# EAGLE design ATMEGA16v4 (EAGLE 7.6.0)

## Sheet 1 of 2
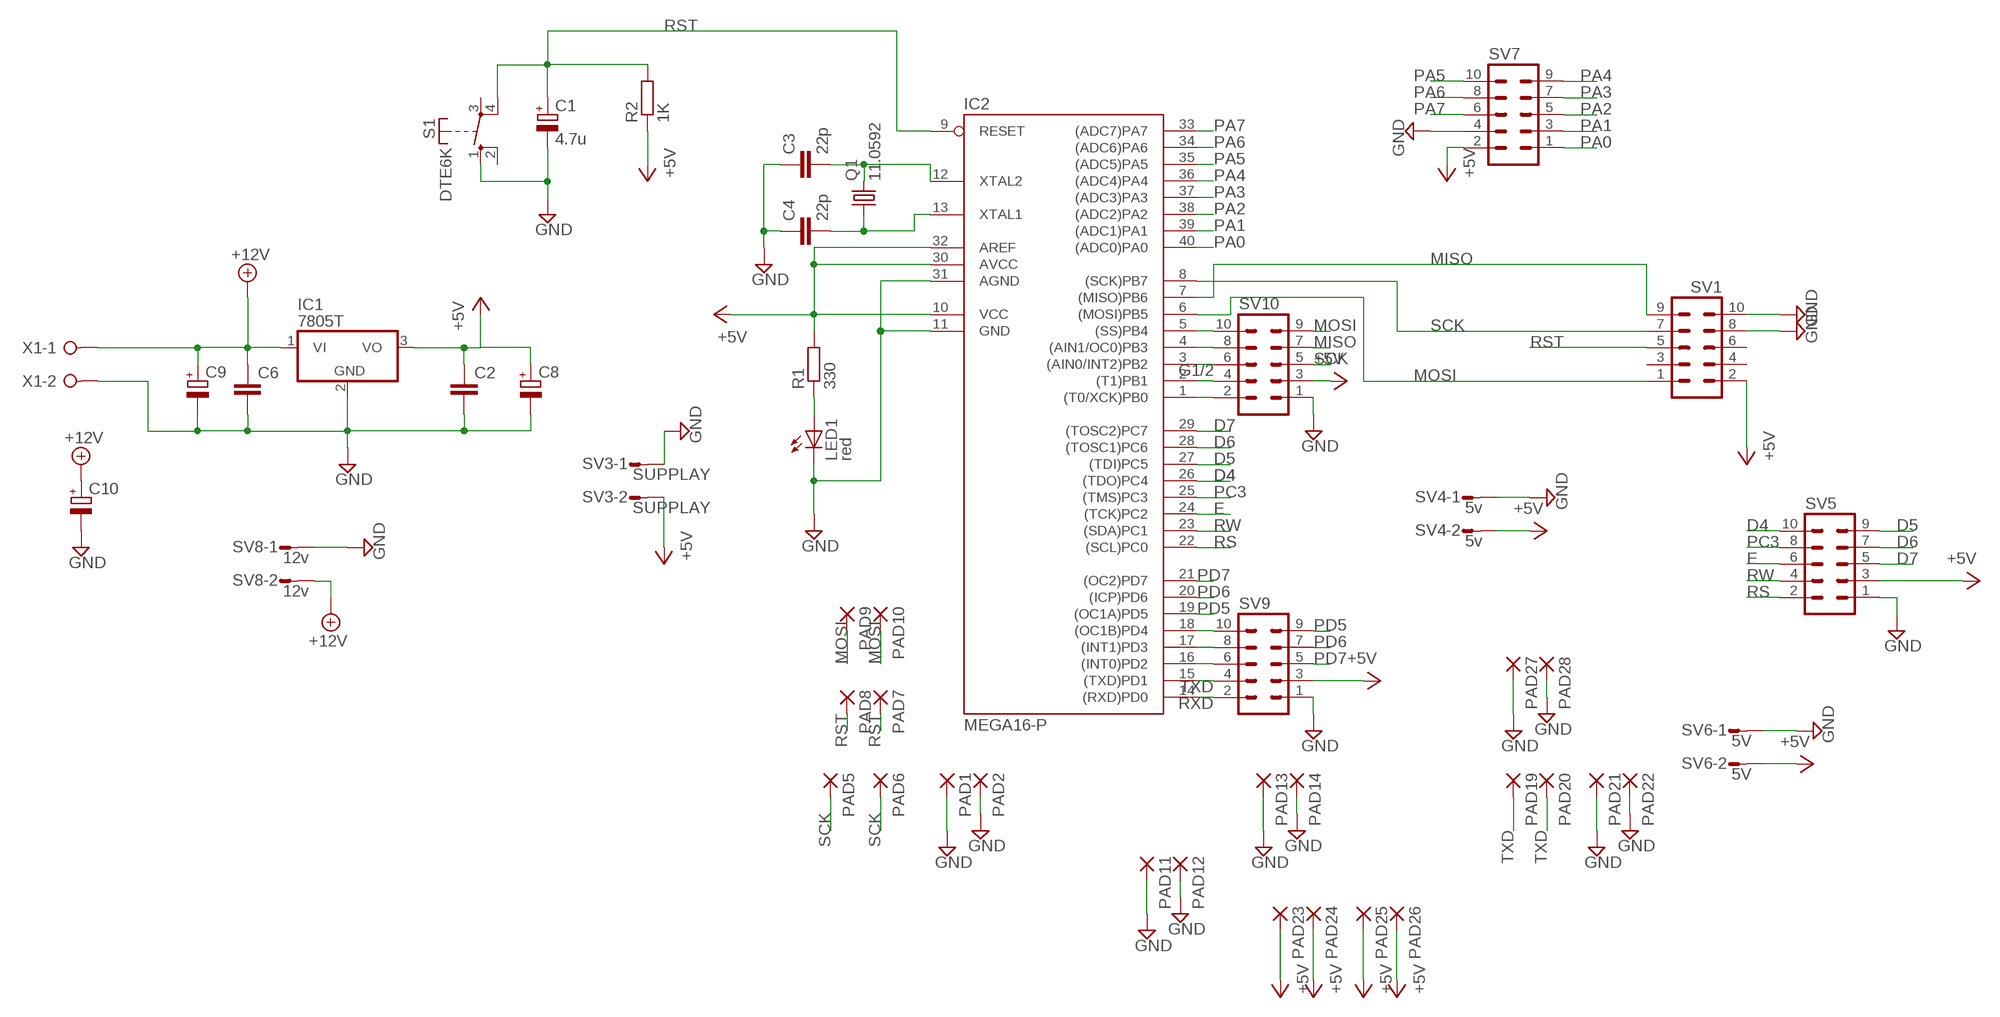
[diagram p0: schematic, sheet 1]

### Parts
C1  4.7u  CPOL-EUE2-5  [E2-5]
C2  C-EU050-050X075  [C050-050X075]
C3  22p  C-EU025-040X050  [C025-040X050]
C4  22p  C-EU025-040X050  [C025-040X050]
C6  C-EU050-050X075  [C050-050X075]
C8  CPOL-EUE2.5-7  [E2,5-7]
C9  CPOL-EUE2.5-7  [E2,5-7]
C10  CPOL-EUE5-13  [E5-13]
IC1  7805T  [TO220H]
IC2  MEGA16-P  [DIL40]
LED1  red  LED3MM  [LED3MM]
PAD1  1,6/0,9  [1,6/0,9]
PAD2  1,6/0,9  [1,6/0,9]
PAD5  1,6/0,9  [1,6/0,9]
PAD6  1,6/0,9  [1,6/0,9]
PAD7  1,6/0,9  [1,6/0,9]
PAD8  1,6/0,9  [1,6/0,9]
PAD9  1,6/0,9  [1,6/0,9]
PAD10  1,6/0,9  [1,6/0,9]
PAD11  1,6/0,9  [1,6/0,9]
PAD12  1,6/0,9  [1,6/0,9]
PAD13  1,6/0,9  [1,6/0,9]
PAD14  1,6/0,9  [1,6/0,9]
PAD19  1,6/0,9  [1,6/0,9]
PAD20  1,6/0,9  [1,6/0,9]
PAD21  1,6/0,9  [1,6/0,9]
PAD22  1,6/0,9  [1,6/0,9]
PAD23  1,6/0,9  [1,6/0,9]
PAD24  1,6/0,9  [1,6/0,9]
PAD25  1,6/0,9  [1,6/0,9]
PAD26  1,6/0,9  [1,6/0,9]
PAD27  1,6/0,9  [1,6/0,9]
PAD28  1,6/0,9  [1,6/0,9]
Q1  11.0592  CRYSTALHC49U-V  [HC49U-V]
R1  330  R-EU_0309/12  [0309/12]
R2  1K  R-EU_0309/12  [0309/12]
S1  DTE6K  [DTE6K]
SV1  ML10  [ML10]
SV3  SUPPLAY  L02P  [L02P]
SV4  5v  L02P  [L02P]
SV5  ML10  [ML10]
SV6  5V  L02P  [L02P]
SV7  ML10  [ML10]
SV8  12v  L02P  [L02P]
SV9  ML10  [ML10]
SV10  ML10  [ML10]
X1  W237-02P  [W237-132]

### Nets
+5V: C2.1 C8.+ IC1.3(VO) IC2.10(VCC) IC2.30(AVCC) IC2.32(AREF) PAD23.1(P) PAD24.1(P) PAD25.1(P) PAD26.1(P) R1.2 R2.1 SV1.2 SV3.2 SV4.2 SV5.3 SV6.2 SV7.2 SV9.3 SV10.3
+12V: C6.1 C9.+ C10.+ IC1.1(VI) SV8.2 X1.1 ; also sheet 2
D4: IC2.26((TDO)PC4) SV5.10
D5: IC2.27((TDI)PC5) SV5.9
D6: IC2.28((TOSC1)PC6) SV5.7
D7: IC2.29((TOSC2)PC7) SV5.5
E: IC2.24((TCK)PC2) SV5.6
G1/2: IC2.2((T1)PB1) SV10.4
GND: C1.- C2.2 C3.1 C4.1 C6.2 C8.- C9.- C10.- IC1.2(GND) IC2.11(GND) IC2.31(AGND) LED1.K(C) PAD1.1(P) PAD2.1(P) PAD11.1(P) PAD12.1(P) PAD13.1(P) PAD14.1(P) PAD21.1(P) PAD22.1(P) PAD27.1(P) PAD28.1(P) S1.1(S) SV1.8 SV1.10 SV3.1 SV4.1 SV5.1 SV6.1 SV7.4 SV8.1 SV9.1 SV10.1 X1.2 ; also sheet 2
MISO: IC2.7((MISO)PB6) SV1.9 SV10.7
MOSI: IC2.6((MOSI)PB5) PAD9.1(P) PAD10.1(P) SV1.1 SV10.9
N$4: LED1.A R1.1
N$5: C3.2 IC2.12(XTAL2) Q1.2
N$6: C4.2 IC2.13(XTAL1) Q1.1
N$16: IC2.18((OC1B)PD4) SV9.10
N$17: IC2.17((INT1)PD3) SV9.8
N$18: IC2.16((INT0)PD2) SV9.6
N$29: IC2.5((SS)PB4) SV10.10
N$30: IC2.4((AIN1/OC0)PB3) SV10.8
N$31: IC2.3((AIN0/INT2)PB2) SV10.6
N$33: IC2.1((T0/XCK)PB0) SV10.2
PA0: IC2.40((ADC0)PA0) SV7.1
PA1: IC2.39((ADC1)PA1) SV7.3
PA2: IC2.38((ADC2)PA2) SV7.5
PA3: IC2.37((ADC3)PA3) SV7.7
PA4: IC2.36((ADC4)PA4) SV7.9
PA5: IC2.35((ADC5)PA5) SV7.10
PA6: IC2.34((ADC6)PA6) SV7.8
PA7: IC2.33((ADC7)PA7) SV7.6
PC3: IC2.25((TMS)PC3) SV5.8
PD5: IC2.19((OC1A)PD5) SV9.9
PD6: IC2.20((ICP)PD6) SV9.7
PD7: IC2.21((OC2)PD7) SV9.5
RS: IC2.22((SCL)PC0) SV5.2
RST: C1.+ IC2.9(RESET) PAD7.1(P) PAD8.1(P) R2.2 S1.4(P) SV1.5
RW: IC2.23((SDA)PC1) SV5.4
RXD: IC2.14((RXD)PD0) SV9.2 ; also sheet 2
SCK: IC2.8((SCK)PB7) PAD5.1(P) PAD6.1(P) SV1.7 SV10.5
TXD: IC2.15((TXD)PD1) PAD19.1(P) PAD20.1(P) SV9.4 ; also sheet 2
Unconnected: S1.2(S) S1.3(P) SV1.3 SV1.4 SV1.6

## Sheet 2 of 2
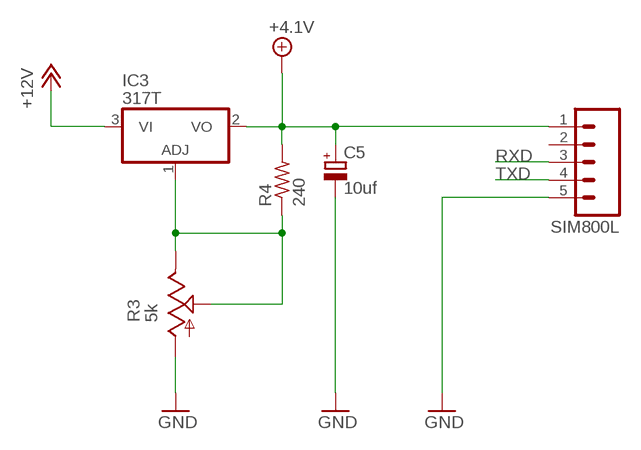
[diagram p1: schematic, sheet 2]

### Parts
C5  10uf  CPOL-EUE2.5-5  [E2,5-5]
IC3  317T  [TO220H]
R3  5k  TRIM_US-CA6V  [CA6V]
R4  240  R-US_0207/12  [0207/12]
SIM800L  M05  [05P]

### Nets
+4.1V: C5.+ IC3.2(VO) R4.2 SIM800L.1
+12V: IC3.3(VI) ; also sheet 1
GND: C5.- R3.A SIM800L.5 ; also sheet 1
N$1: IC3.1(ADJ) R3.E R3.S R4.1
RXD: SIM800L.3 ; also sheet 1
TXD: SIM800L.4 ; also sheet 1
Unconnected: SIM800L.2

## Library data of the parts
C1 C5 C8-C10 = rcl:CPOL-EU: POLARIZED CAPACITOR, European symbol
C2 C6 = rcl:C-EU: CAPACITOR, European symbol
C3 C4 = resistor:C-EU: CAPACITOR, European symbol
IC1 = linear:78*: Positive VOLTAGE REGULATOR Source: http://cache.national.com/ds/LM/LM78L05.pdf http://www.fairchildsemi.com/ds/LM/LM7805.pdf
IC2 = atmel:MEGA16-P: MICROCONTROLLER 16 Kbytes FLASH 1 kbytes SRAM 512 bytes EEPROM USART 8-channel 10 bit ADC Source: avr.lbr
IC3 = linear:*317: Positive VOLTAGE REGULATOR
LED1 = led:LED: LED OSRAM: - CHIPLED LG R971, LG N971, LY N971, LG Q971, LY Q971, LO R971, LY R971 LH N974, LH R974 LS Q976, LO Q976, LY Q976 LO Q996 - Hyper CHIPLED LW Q18S LB Q993, LB Q99A, LB R99A - SideLED LS A670, LO A670, LY A670, LG A670, LP A670 LB A673, LV A673, LT A673, LW A673 LH A674 LY A675 LS A676, LA A676, LO A676, LY A676, LW A676 LS A679, LY A679, LG A679 - Hyper Micro SIDELED® LS Y876, LA Y876, LO Y876, LY Y876 LT Y87S - SmartLED LW L88C, LW L88S LB L89C, LB L89S, LG L890 LS L89K, LO L89K, LY L89K LS L896, LA L896, LO L896, LY L896 - TOPLED LS T670, LO T670, LY T670, LG T670, LP T670 LSG T670, LSP T670, LSY T670, LOP T670, LYG T670 LG T671, LOG T671, LSG T671 LB T673, LV T673, LT T673, LW T673 LH T674 LS T676, LA T676, LO T676, LY T676, LB T676, LH T676, LSB T676, LW T676 LB T67C, LV T67C, LT T67C, LS T67K, LO T67K, LY T67K, LW E67C LS E67B, LA E67B, LO E67B, LY E67B, LB E67C, LV E67C, LT E67C LW T67C LS T679, LY T679, LG T679 LS T770, LO T770, LY T770, LG T770, LP T770 LB T773, LV T773, LT T773, LW T773 LH T774 LS E675, LA E675, LY E675, LS T675 LS T776, LA T776, LO T776, LY T776, LB T776 LHGB T686 LT T68C, LB T68C - Hyper Mini TOPLED® LB M676 - Mini TOPLED Santana® LG M470 LS M47K, LO M47K, LY M47K Source: http://www.osram.convergy.de LUXEON: - LUMILED® LXK2-PW12-R00, LXK2-PW12-S00, LXK2-PW14-U00, LXK2-PW14-V00 LXK2-PM12-R00, LXK2-PM12-S00, LXK2-PM14-U00 LXK2-PE12-Q00, LXK2-PE12-R00, LXK2-PE12-S00, LXK2-PE14-T00, LXK2-PE14-U00 LXK2-PB12-K00, LXK2-PB12-L00, LXK2-PB12-M00, LXK2-PB14-N00, LXK2-PB14-P00, LXK2-PB14-Q00 LXK2-PR12-L00, LXK2-PR12-M00, LXK2-PR14-Q00, LXK2-PR14-R00 LXK2-PD12-Q00, LXK2-PD12-R00, LXK2-PD12-S00 LXK2-PH12-R00, LXK2-PH12-S00 LXK2-PL12-P00, LXK2-PL12-Q00, LXK2-PL12-R00 Source: www.luxeon.com KINGBRIGHT: KA-3528ASYC Source: www.kingbright.com
PAD1 PAD2 PAD5-PAD14 PAD19-PAD28 = wirepad:1,6/0,9: THROUGH-HOLE PAD
Q1 = crystal:CRYSTAL: CRYSTAL
R1 R2 = resistor:R-EU_: RESISTOR, European symbol
R3 = pot:TRIM_US-: POTENTIOMETER
R4 = rcl:R-US_: RESISTOR, American symbol
S1 = switch-misc:DT: ITT SWITCH
SIM800L = con-amp-quick:M05: AMP QUICK CONNECTOR; OC_FARNELL: unknown; OC_NEWARK: unknown
SV1 SV5 SV7 SV9 SV10 = con-harting-ml:ML10: HARTING; OC_FARNELL: unknown; OC_NEWARK: unknown
SV3 SV4 SV6 SV8 = con-amp-mt:L02P: AMP MT CONNECTOR; OC_FARNELL: unknown; OC_NEWARK: unknown
X1 = con-wago-508:W237-02P: WAGO SREW CLAMP; OC_FARNELL: unknown; OC_NEWARK: unknown

## Net classes
0 default: width 1.524 mm, drill 1.524 mm, clearance 1.016 mm

## Board
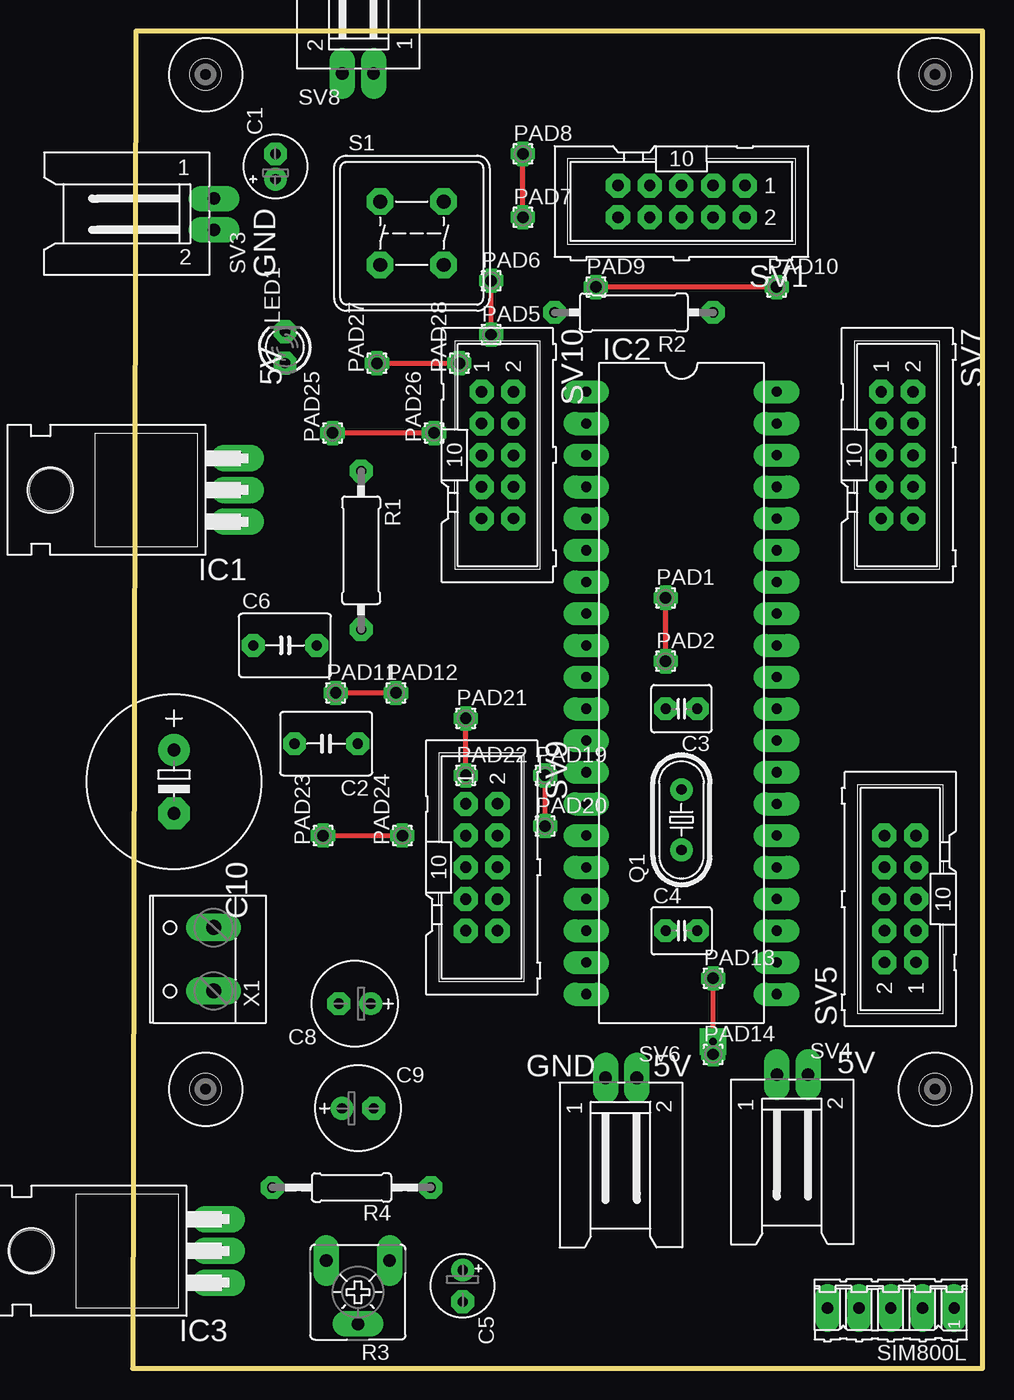
[diagram p2: board, top side]
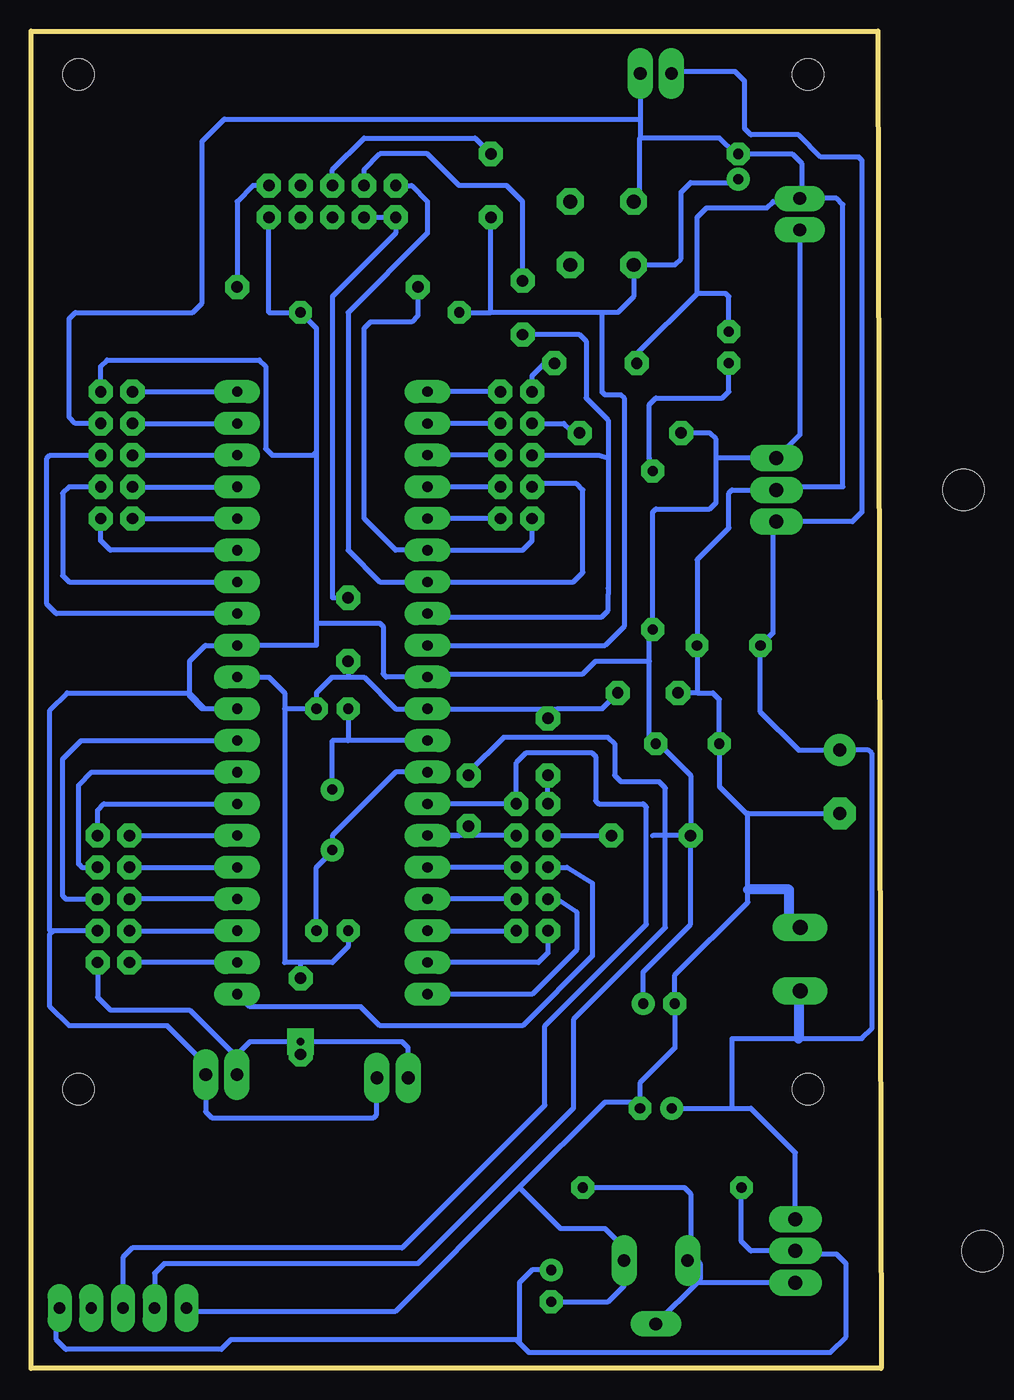
[diagram p3: board, bottom side, seen from below]

Size 68.05 x 107.11 mm. Coordinates in mm from the lower left corner, seen from the top.
Outline: 0,0 68.05,0 68.05,107.11 0.25,107.11 0,0
Copper layers 16: Bottom 0.035mm
Design rules "setting": minimum track width 30mil, minimum drill 25mil, track to track 30mil, track to pad 30mil, pad to pad 30mil, via to via 30mil, smd to smd 8mil, copper to edge 50mil, drill to drill 30mil, minimum pad ring 20mil, minimum via ring 30mil, stop-mask expansion 0mil, vias tented up to drill 0mil, thermal gap 10mil

### Footprints (pad centres in the part's own frame; a part is rotated, then mirrored left to right if it is on the bottom)
E2-5 = drill 0.813 pad 1.27: + -1.016,0 | drill 0.813 pad 1.27 octagon: - 1.016,0
C050-050X075 = drill 0.813 octagon: 1 -2.54,0; 2 2.54,0
C025-040X050 = drill 0.813 octagon: 1 -1.27,0; 2 1.27,0
E2,5-5 = drill 0.813 pad 1.6: + -1.27,0 | drill 0.813 pad 1.6 octagon: - 1.27,0
E2,5-7 = drill 0.813 pad 1.6: + -1.27,0 | drill 0.813 pad 1.6 octagon: - 1.27,0
E5-13 = drill 1.016 pad 2.54: + -2.54,0 | drill 1.016 pad 2.54 octagon: - 2.54,0
TO220H = drill 1.118 long: 1 -2.54,-10.16; 2 0,-10.16; 3 2.54,-10.16 | hole 3.302: 0,4.826
DIL40 = drill 0.813 long: 1 -24.13,-7.62; 2 -21.59,-7.62; 3 -19.05,-7.62; 4 -16.51,-7.62; 5 -13.97,-7.62; 6 -11.43,-7.62; 7 -8.89,-7.62; 8 -6.35,-7.62; 9 -3.81,-7.62; 10 -1.27,-7.62; 11 1.27,-7.62; 12 3.81,-7.62; 13 6.35,-7.62; 14 8.89,-7.62; 15 11.43,-7.62; 16 13.97,-7.62; 17 16.51,-7.62; 18 19.05,-7.62; 19 21.59,-7.62; 20 24.13,-7.62; 21 24.13,7.62; 22 21.59,7.62; 23 19.05,7.62; 24 16.51,7.62; 25 13.97,7.62; 26 11.43,7.62; 27 8.89,7.62; 28 6.35,7.62; 29 3.81,7.62; 30 1.27,7.62; 31 -1.27,7.62; 32 -3.81,7.62; 33 -6.35,7.62; 34 -8.89,7.62; 35 -11.43,7.62; 36 -13.97,7.62; 37 -16.51,7.62; 38 -19.05,7.62; 39 -21.59,7.62; 40 -24.13,7.62
LED3MM = drill 0.813 octagon: A -1.27,0; K 1.27,0
1,6/0,9 = drill 0.914 pad 1.6 octagon: 1 0,0
HC49U-V = drill 0.813: 1 -2.413,0; 2 2.413,0
0309/12 = drill 0.813 octagon: 1 -6.35,0; 2 6.35,0
CA6V = drill 1.016 long: A -2.54,-2.54; E 2.54,-2.54; S 0,2.54
0207/12 = drill 0.813 octagon: 1 -6.35,0; 2 6.35,0
DTE6K = drill 1.118 octagon: 1 -2.54,2.54; 2 2.54,2.54; 3 2.54,-2.54; 4 -2.54,-2.54
05P = drill 0.914 long: 1 -5.08,0; 2 -2.54,0; 3 0,0; 4 2.54,0; 5 5.08,0
ML10 = drill 0.914 octagon: 1 -5.08,-1.27; 2 -5.08,1.27; 3 -2.54,-1.27; 4 -2.54,1.27; 5 0,-1.27; 6 0,1.27; 7 2.54,-1.27; 8 2.54,1.27; 9 5.08,-1.27; 10 5.08,1.27
L02P = drill 1.016 long: 1 1.25,-6.25; 2 -1.25,-6.25
DRIL-2,5 = hole 2.5: 0,0
W237-132 = drill 1.194 long: 1 -2.54,-0.635; 2 2.54,-0.635

### Placement (x,y rotation side)
C1  11.43,96.27 90 top
C2  15.49,50.04 180 top
C3  43.94,52.83 180 top
C4  43.94,35.05 0 top
C5  26.42,6.6 270 top
C6  12.19,57.91 0 top
C8  17.78,29.21 180 top
C9  18.03,20.83 0 top
C10  3.3,46.99 270 top
IC1  -1.78,70.36 90 top
IC2  43.94,54.1 270 top
IC3  -3.3,9.4 90 top
LED1  12.19,81.79 90 top
PAD1  42.67,61.72 0 top
PAD2  42.67,56.64 0 top
PAD5  28.7,82.8 0 top
PAD6  28.7,87.12 0 top
PAD7  31.24,92.2 0 top
PAD8  31.24,97.28 0 top
PAD9  37.08,86.61 0 top
PAD10  51.56,86.61 0 top
PAD11  16.26,54.1 0 top
PAD12  21.08,54.1 0 top
PAD13  46.48,31.24 0 top
PAD14  46.48,25.15 0 top
PAD19  33.02,47.5 0 top
PAD20  33.02,43.43 0 top
PAD21  26.67,52.07 0 top
PAD22  26.67,47.5 0 top
PAD23  15.24,42.67 90 top
PAD24  21.59,42.67 90 top
PAD25  16,74.93 90 top
PAD26  24.13,74.93 90 top
PAD27  19.56,80.52 90 top
PAD28  26.16,80.52 90 top
Q1  43.94,43.94 90 top
R1  18.29,65.53 270 top
R2  40.13,84.58 180 top
R3  18.03,6.1 180 top
R4  17.53,14.48 180 top
S1  22.35,90.93 0 top
SIM800L  60.71,4.83 180 top
SV1  43.94,93.47 180 top
SV3  0.25,92.46 90 top
SV4  52.83,17.27 180 top
SV5  61.47,37.59 90 top
SV6  39.12,17.02 180 top
SV7  61.21,73.15 270 top
SV8  18.03,109.98 0 top
SV9  27.94,40.13 270 top
SV10  29.21,73.15 270 top
U$1  [DRIL-2,5]  5.84,103.63 0 top
U$2  [DRIL-2,5]  64.26,103.63 0 top
U$3  [DRIL-2,5]  64.26,22.35 0 top
U$4  [DRIL-2,5]  5.84,22.35 0 top
X1  5.84,32.77 90 top

### Tracks (layer width: path | path; a pad name or v marks a point on that pad's centre or on a via)
+4.1V
  Bottom 0.406: R4.2 11.18,10.16 10.41,9.4 IC3.2 6.6,9.14 3.56,9.14 2.79,8.38 2.79,2.54 4.06,1.27 28.19,1.27 28.96,2.03 | C5.+ 27.94,7.87 28.96,6.86 28.96,2.03 | 28.96,2.03 29.21,2.29 52.07,2.29 52.83,1.52 65.28,1.52 66.04,2.29 66.04,4.57 SIM800L.1
+5V
  Top 0.406: PAD23.1 PAD24.1 | PAD26.1 PAD25.1
  Bottom 0.406: SV1.2 49.02,84.58 R2.1 45.21,83.31 45.21,73.41 | IC2.30 54.1,52.83 | 54.1,52.83 55.37,54.1 | 55.37,54.1 55.37,56.64 54.1,57.91 IC2.32 45.21,57.91 45.21,59.69 | 45.21,73.41 45.21,59.69 | 54.1,52.83 54.36,52.83 55.37,53.85 | SV5.3 66.29,35.05 | 66.29,35.05 66.55,35.05 66.55,52.73 65.18,54.1 55.37,54.1 | 66.29,35.05 66.55,34.8 66.55,28.96 65.02,27.43 57.15,27.43 54.08,24.36 SV4.2 54.08,20.55 53.59,20.07 40.64,20.07 40.39,20.32 40.39,23.25 SV6.2 | SV7.2 62.48,80.26 61.98,80.77 49.78,80.77 49.28,80.26 49.28,73.66 48.77,73.15 45.47,73.15 45.21,73.41 | SV9.3 PAD24.1 | SV10.3 25.4,75.69 24.89,75.18 24.38,75.18 PAD26.1 | 13.21,72.9 13.21,69.34 13.72,68.83 18.03,68.83 18.29,68.58 R1.2 18.54,58.93 18.54,56.64 | 13.21,72.9 13.21,74.42 13.72,74.93 PAD25.1 | 13.21,72.9 IC1.3 6.5,74.78 SV3.2 | 18.54,56.64 18.54,50.55 C2.1 17.78,50.04 15.24,47.5 PAD23.1 | 18.54,56.64 22.86,56.64 23.88,55.63 36.07,55.63 IC2.10 39.62,55.37 39.88,55.63 39.88,59.44 40.13,59.69 45.21,59.69 | PAD23.1 18.29,42.67 | C8.+ 19.05,31.75 15.24,35.56 PAD23.1
+12V
  Bottom 0.406: IC3.3 6.86,17.27 10.41,20.83 11.94,20.83 | 11.94,20.83 11.94,26.42 6.6,26.42 1.52,26.42 0.76,27.18 0.76,49.28 1.02,49.53 C10.+ 6.6,49.53 9.65,52.58 C6.1 8.64,58.93 8.64,67.56 IC1.1 2.29,67.82 1.52,68.58 1.52,96.77 1.78,97.03 4.83,97.03 6.6,98.81 10.41,98.81 10.92,99.31 10.92,103.12 11.68,103.89 16.63,103.89 SV8.2 | C9.+ 11.94,20.83
  Bottom 0.813: X1.1 6.6,30.23 6.6,26.42
D4
  Bottom 0.406: SV5.10 IC2.26
D5
  Bottom 0.406: SV5.9 62.74,44.7 62.23,45.21 IC2.27
D6
  Bottom 0.406: IC2.28 63.22,47.75 64.26,46.7 64.26,40.39 64.01,40.13 SV5.7
D7
  Bottom 0.406: IC2.29 64.05,50.29 65.53,48.81 65.53,37.85 65.28,37.59 SV5.5
E
  Bottom 0.406: IC2.24 SV5.6
G1/2
  Bottom 0.406: SV10.4 IC2.2
GND  (via drill 0.6)
  Top 0.406: PAD12.1 PAD11.1 | v46.48,26.16 PAD13.1 | PAD2.1 PAD1.1 | PAD22.1 PAD21.1 | PAD27.1 PAD28.1
  Bottom 0.406: 47.75,52.83 47.75,54.1 49.02,55.37 IC2.31 | 47.75,52.83 47.75,32.51 46.48,32.51 | SV1.8 SV1.10 38.86,90.93 43.94,85.85 43.94,61.72 PAD1.1 | C4.1 42.67,33.78 43.94,32.51 46.48,32.51 | 47.75,52.83 C3.1 45.21,54.1 43.94,55.37 42.67,55.37 | 36.58,52.83 IC2.11 25.91,52.83 | PAD13.1 46.48,32.51 | 36.58,52.83 38.86,52.83 41.4,55.37 42.67,55.37 | 36.58,52.83 36.32,52.58 | 19.3,98.55 12.95,98.55 11.68,97.28 C1.- 7.11,97.28 6.35,96.52 6.35,93.86 SV3.1 | PAD2.1 42.67,55.37 | PAD12.1 22.35,52.83 25.91,52.83 | 14.73,54.1 PAD11.1 | SV5.1 62.74,29.72 61.72,28.7 55.37,28.7 51.69,25.02 | 51.69,25.02 51.56,24.89 51.56,23.54 SV4.1 | 51.69,25.02 50.55,26.16 v46.48,26.16 | SV6.1 37.87,25.67 38.35,26.16 v46.48,26.16 | PAD14.1 v46.48,26.16 | 25.91,52.83 PAD21.1 26.67,52.32 | SV9.1 PAD22.1 | SV10.1 27.94,79.5 26.92,80.52 PAD28.1 | C5.- 21.84,5.33 20.57,6.6 R3.A 20.57,9.65 22.1,11.18 25.65,11.18 28.96,14.48 | SIM800L.5 55.37,4.57 38.86,4.57 28.96,14.48 | 4.11,44.4 4.06,44.45 | 4.06,44.45 C10.- | SV8.1 19.28,100.08 | 19.28,100.08 19.28,98.57 19.3,98.55 | 10.67,44.45 10.8,44.45 12.95,46.6 C2.2 12.95,53.59 13.46,54.1 14.73,54.1 | 10.67,44.45 4.06,44.45 | 10.67,44.45 10.67,38.35 10.67,37.34 16.51,31.5 C8.- 16.51,25.65 19.3,22.86 19.3,21.34 | 19.3,21.34 C9.- | 28.96,14.48 22.1,21.34 19.3,21.34 | SV7.4 64.52,75.69 65.02,76.2 65.02,84.07 64.52,84.58 55.12,84.58 54.36,85.34 54.36,98.3 52.58,100.08 19.28,100.08 | S1.1 19.81,93.73 19.3,94.23 19.3,98.55 | 14.73,54.1 C6.2 14.73,64.77 12.19,67.31 12.19,70.1 11.94,70.36 IC1.2 8.13,70.61 3.05,70.61 3.05,93.22 3.56,93.73 6.48,93.73 SV3.1 | 14.73,86.11 14.73,92.2 13.97,92.96 9.14,92.96 8.64,93.47 6.74,93.47 SV3.1
  Bottom 0.406: LED1.K 12.19,85.85 12.45,86.11 14.73,86.11 | 14.73,86.11 19.56,81.28 PAD27.1
  Bottom 0.813: X1.2 7.37,35.31 7.37,38.35 10.67,38.35
MISO
  Bottom 0.406: SV1.9 37.59,94.74 36.32,93.47 36.32,90.93 42.67,84.58 42.67,65.53 40.13,62.99 IC2.7 24.64,62.99 23.88,63.75 23.88,70.36 24.38,70.87 27.69,70.87 SV10.7
MOSI
  Top 0.406: PAD10.1 PAD9.1
  Bottom 0.406: SV1.1 50.29,94.74 51.56,93.47 PAD10.1 | SV10.9 27.94,66.29 28.7,65.53 IC2.6 38.86,65.53 41.4,68.07 41.4,83.31 40.89,83.82 37.59,83.82 37.08,84.33 PAD9.1
N$1
  Bottom 0.406: 14.6,6.98 14.48,7.11 14.48,8.38 14.73,8.64 R3.E 15.24,8.89 15.24,13.97 15.75,14.48 R4.1 | 14.6,6.98 R3.S | IC3.1 14.48,6.86 14.6,6.98
N$4
  Bottom 0.406: R1.1 18.54,72.9 18.54,77.22 18.03,77.72 12.7,77.72 12.19,78.23 LED1.A
N$5
  Bottom 0.406: 43.94,46.48 Q1.2 43.94,50.29 42.67,50.29 | IC2.12 42.67,50.29 | C3.2 42.67,50.29
N$6
  Bottom 0.406: C4.2 45.21,40.13 43.94,41.4 Q1.1 43.94,42.67 38.86,47.75 IC2.13
N$16
  Bottom 0.406: IC2.18 SV9.10
N$17
  Bottom 0.406: SV9.8 IC2.17
N$18
  Bottom 0.406: SV9.6 IC2.16
N$29
  Bottom 0.406: SV10.10 IC2.5
N$30
  Bottom 0.406: SV10.8 IC2.4
N$31
  Bottom 0.406: SV10.6 IC2.3
N$33
  Bottom 0.406: SV10.2 IC2.1
PA0
  Bottom 0.406: SV7.1 IC2.40
PA1
  Bottom 0.406: SV7.3 IC2.39
PA2
  Bottom 0.406: SV7.5 IC2.38
PA3
  Bottom 0.406: SV7.7 IC2.37
PA4
  Bottom 0.406: SV7.9 IC2.36
PA5
  Bottom 0.406: IC2.35 61.72,65.53 62.48,66.29 SV7.10
PA6
  Bottom 0.406: SV7.8 65.02,70.61 65.53,70.1 65.53,63.5 65.02,62.99 IC2.34
PA7
  Bottom 0.406: IC2.33 66.04,60.45 66.8,61.21 66.8,72.9 66.55,73.15 SV7.6
PC3
  Bottom 0.406: SV5.8 IC2.25
PD5
  Bottom 0.406: SV9.9 26.67,33.27 27.43,32.51 IC2.19
PD6
  Bottom 0.406: SV9.7 25.91,37.59 24.38,36.58 24.38,33.53 27.94,29.97 IC2.20
PD7
  Bottom 0.406: SV9.5 25.15,40.13 23.11,38.86 23.11,33.02 28.7,27.43 40.13,27.43 41.66,28.96 50.55,28.96 IC2.21
RS
  Bottom 0.406: IC2.22 SV5.2
RST
  Top 0.406: PAD7.1 PAD8.1
  Bottom 0.406: 22.35,84.58 21.08,84.58 19.81,85.85 S1.4 16.51,88.39 16,88.9 16,94.23 15.24,95 11.68,95 C1.+ | 22.35,84.58 31.24,84.58 | R2.2 31.24,84.58 | 31.24,84.58 PAD7.1 | SV1.5 43.94,96.01 41.4,98.55 32.51,98.55 PAD8.1 | IC2.9 22.1,57.91 20.57,59.44 20.57,77.72 20.83,77.98 22.1,77.98 22.35,78.23 22.35,84.58
RW
  Bottom 0.406: SV5.4 IC2.23
RXD
  Bottom 0.406: IC2.14 SV9.2 29.21,48.51 28.45,49.28 23.11,49.28 22.86,49.02 22.86,45.47 22.61,45.21 19.05,45.21 18.8,44.96 18.8,35.56 26.92,27.43 26.92,21.08 38.35,9.65 59.94,9.65 60.71,8.89 SIM800L.3
SCK
  Top 0.406: PAD5.1 PAD6.1
  Bottom 0.406: SV1.7 41.4,96.01 40.13,97.28 36.32,97.28 33.78,94.74 29.97,94.74 28.7,93.47 PAD6.1 | IC2.8 35.05,60.45 34.8,60.2 22.35,60.2 21.84,60.71 21.84,61.98 21.84,62.48 21.84,72.9 | 21.84,72.9 21.84,75.95 23.62,77.72 23.62,82.3 24.13,82.8 PAD5.1 | SV10.5 22.61,73.15 21.84,72.9
TXD
  Top 0.406: PAD20.1 PAD19.1
  Bottom 0.406: SV9.4 IC2.15 33.78,42.67 PAD20.1 | PAD19.1 33.02,47.75 30.23,50.55 21.84,50.55 21.34,50.04 21.34,47.5 20.83,46.99 17.78,46.99 17.27,46.48 17.27,35.31 24.64,27.94 24.64,20.83 37.08,8.38 57.4,8.38 58.17,7.62 SIM800L.4

### Text on the board
tPlace: GND | 5V | GND | 5V | 5V
Document: SIM800L